# Altium schematic sheet R88_R98.SchDoc
size A4
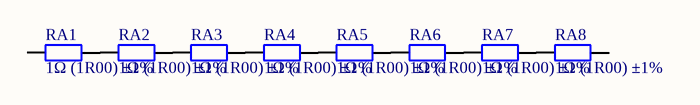
[diagram p0: R88_R98.SchDoc]

## Parts
RA1  1Ω (1R00) ±1%  [0805_R]
RA2  1Ω (1R00) ±1%  [0805_R]
RA3  1Ω (1R00) ±1%  [0805_R]
RA4  1Ω (1R00) ±1%  [0805_R]
RA5  1Ω (1R00) ±1%  [0805_R]
RA6  1Ω (1R00) ±1%  [0805_R]
RA7  1Ω (1R00) ±1%  [0805_R]
RA8  1Ω (1R00) ±1%  [0805_R]

## Nets
NetRA1_2: RA1.2 RA2.1
NetRA2_2: RA2.2 RA3.1
NetRA3_2: RA3.2 RA4.1
NetRA4_2: RA4.2 RA5.1
NetRA5_2: RA5.2 RA6.1
NetRA6_2: RA6.2 RA7.1
NetRA7_2: RA7.2 RA8.1

Not connected (* = marked no-connect by the designer): RA1 1; RA8 2

## Library data of the parts
RA1-RA8 = 0805 1Ω (1R00) 1%: 贴片电阻; ComponentLink1Description: 供应商链接; ComponentLink1URL: http://www.szlcsc.com/product/details_26014.html; Package: 0805; Supplier: LC; SuppliersPartNumber: C25271